# EAGLE design iridia-tam-left-board (EAGLE 6.1)
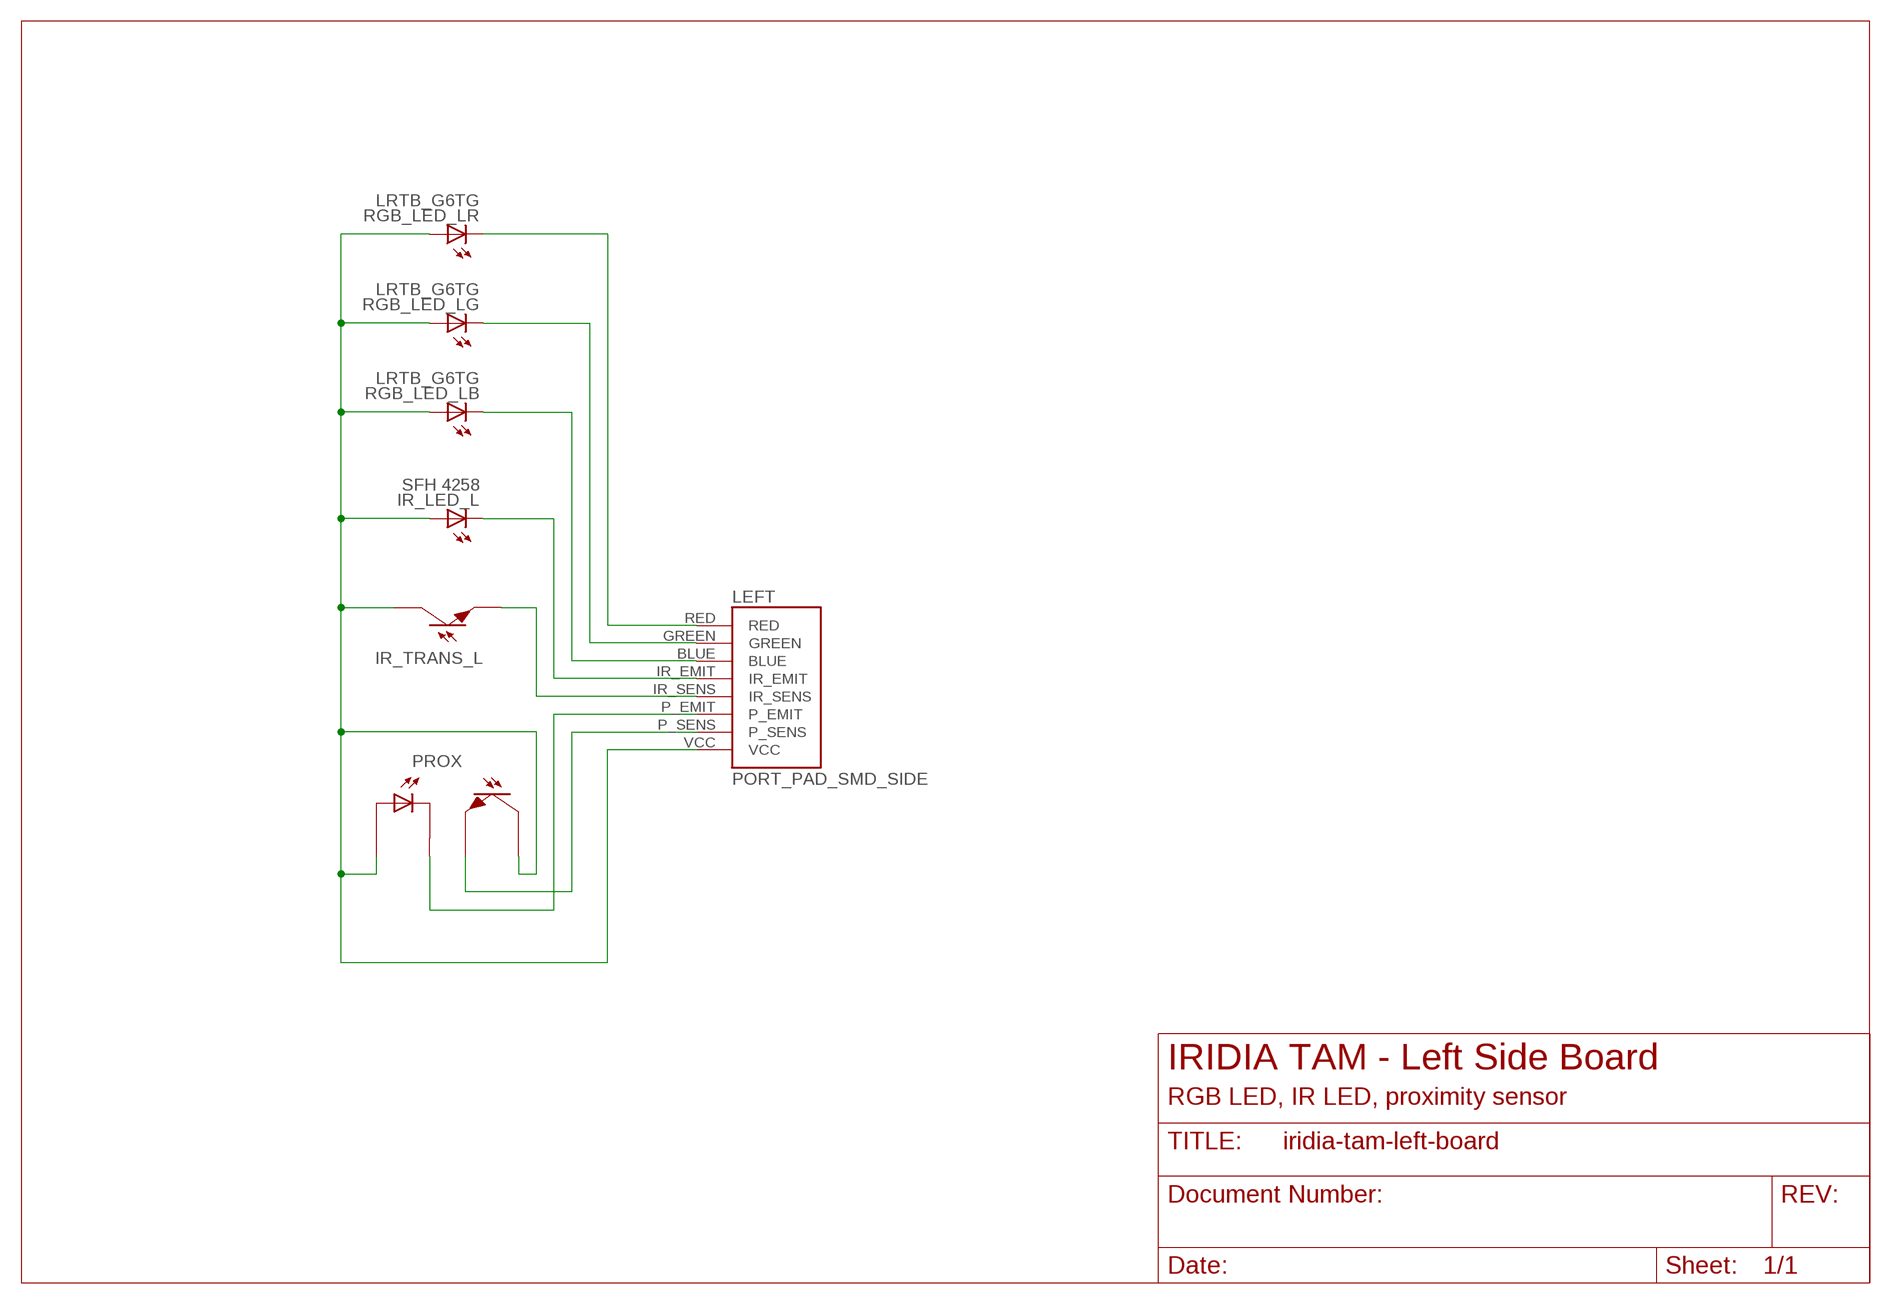
[diagram p0: schematic, sheet 1]

## Parts
IR_LED_L  SFH 4258  LEDP-LCC-4  [P-LCC-4-1C-3A]
IR_TRANS_L  SFH 320 FA  IR_TRANSP-LCC-2  [P-LCC-2-TRANS]
LEFT  PORT_PAD_SMD_SIDE  [PORT_PAD_SMD_SIDE]
PROX  TCRT1000  TCRT1000_TH  [TCRT1000_TH]
RGB_LED_L  LRTB_G6TG  MULTILED_LRTB_G6TG  [P-LCC-6_TOPLED]

## Nets
BLUE_L: LEFT.BLUE RGB_LED_L.C3(B:C)
GREEN_L: LEFT.GREEN RGB_LED_L.C2(G:C)
IR_EMIT_L: IR_LED_L.C@1(C) LEFT.IR_EMIT
IR_SENSE_L: IR_TRANS_L.E LEFT.IR_SENS
PROX_EMIT: LEFT.P_EMIT PROX.CAT
PROX_SENSE: LEFT.P_SENS PROX.E
RED_L: LEFT.RED RGB_LED_L.C1(R:C)
VCC [power]: IR_LED_L.A@2(A) IR_LED_L.A@3(A) IR_LED_L.A@4(A) IR_TRANS_L.COL LEFT.VCC PROX.A PROX.COL RGB_LED_L.A1(R:A) RGB_LED_L.A2(G:A) RGB_LED_L.A3(B:A)

## Notes on the sheet
- IRIDIA TAM - Left Side Board
- RGB LED, IR LED, proximity sensor

## Library data of the parts
IR_LED_L = iridia:LED: LED OSRAM: - CHIPLED LG R971, LG N971, LY N971, LG Q971, LY Q971, LO R971, LY R971 LH N974, LH R974 LS Q976, LO Q976, LY Q976 LO Q996 - Hyper CHIPLED LW Q18S LB Q993, LB Q99A, LB R99A - SideLED LS A670, LO A670, LY A670, LG A670, LP A670 LB A673, LV A673, LT A673, LW A673 LH A674 LY A675 LS A676, LA A676, LO A676, LY A676, LW A676 LS A679, LY A679, LG A679 - Hyper Micro SIDELED® LS Y876, LA Y876, LO Y876, LY Y876 LT Y87S - SmartLED LW L88C, LW L88S LB L89C, LB L89S, LG L890 LS L89K, LO L89K, LY L89K LS L896, LA L896, LO L896, LY L896 - TOPLED LS T670, LO T670, LY T670, LG T670, LP T670 LSG T670, LSP T670, LSY T670, LOP T670, LYG T670 LG T671, LOG T671, LSG T671 LB T673, LV T673, LT T673, LW T673 LH T674 LS T676, LA T676, LO T676, LY T676, LB T676, LH T676, LSB T676, LW T676 LB T67C, LV T67C, LT T67C, LS T67K, LO T67K, LY T67K, LW E67C LS E67B, LA E67B, LO E67B, LY E67B, LB E67C, LV E67C, LT E67C LW T67C LS T679, LY T679, LG T679 LS T770, LO T770, LY T770, LG T770, LP T770 LB T773, LV T773, LT T773, LW T773 LH T774 LS E675, LA E675, LY E675, LS T675 LS T776, LA T776, LO T776, LY T776, LB T776 LHGB T686 LT T68C, LB T68C - Hyper Mini TOPLED® LB M676 - Mini TOPLED Santana® LG M470 LS M47K, LO M47K, LY M47K Source: http://www.osram.convergy.de LUXEON: - LUMILED® LXK2-PW12-R00, LXK2-PW12-S00, LXK2-PW14-U00, LXK2-PW14-V00 LXK2-PM12-R00, LXK2-PM12-S00, LXK2-PM14-U00 LXK2-PE12-Q00, LXK2-PE12-R00, LXK2-PE12-S00, LXK2-PE14-T00, LXK2-PE14-U00 LXK2-PB12-K00, LXK2-PB12-L00, LXK2-PB12-M00, LXK2-PB14-N00, LXK2-PB14-P00, LXK2-PB14-Q00 LXK2-PR12-L00, LXK2-PR12-M00, LXK2-PR14-Q00, LXK2-PR14-R00 LXK2-PD12-Q00, LXK2-PD12-R00, LXK2-PD12-S00 LXK2-PH12-R00, LXK2-PH12-S00 LXK2-PL12-P00, LXK2-PL12-Q00, LXK2-PL12-R00 Source: www.luxeon.com KINGBRIGHT: KA-3528ASYC Source: www.kingbright.com
IR_TRANS_L = iridia:IR_TRANS: IR TRANSITOR Package P-LCC-2 Osram SFH 320, SFH 320 FA
LEFT = iridia:PORT_PAD_SMD_SIDE: Connector pad for soldering side boards on side board of IRIDIA TAM
PROX = iridia:TCRT1000_TH
RGB_LED_L = led:MULTILED_LRTB_G6TG: 6-lead MULTILED® Enhanced optical Power LED (ThinFilm® / ThinGaN®) Source. OSRAM - LRTB_G6TG.pdf

## Net classes
0 default: width 0.254 mm, drill 0.305 mm, clearance 0.152 mm
1 power: width 0.61 mm, drill 0.508 mm, clearance 0.152 mm
2 gnd: width 0.305 mm, drill 0.508 mm, clearance 0.152 mm
3 usbvcc: width 0.508 mm, drill 0.508 mm, clearance 0.152 mm
4 aref: width 0.406 mm

## Board
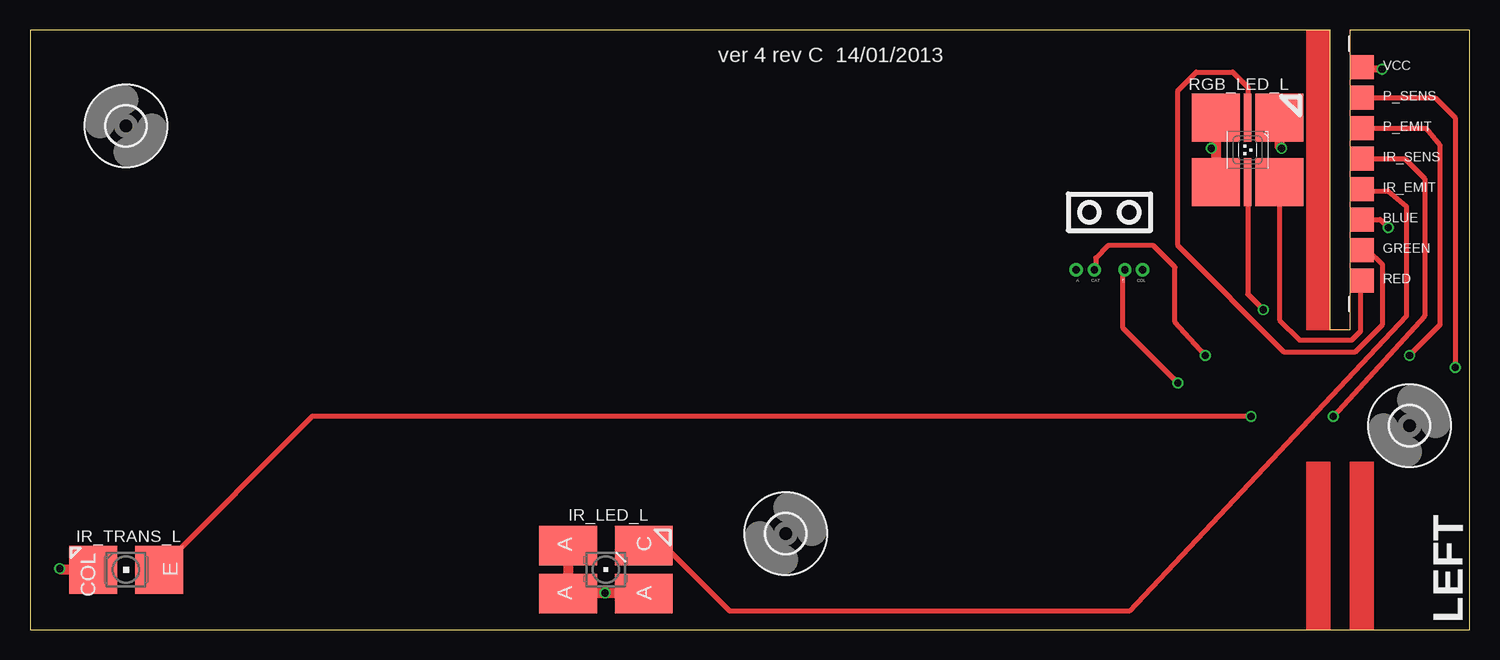
[diagram p1: board, top side]
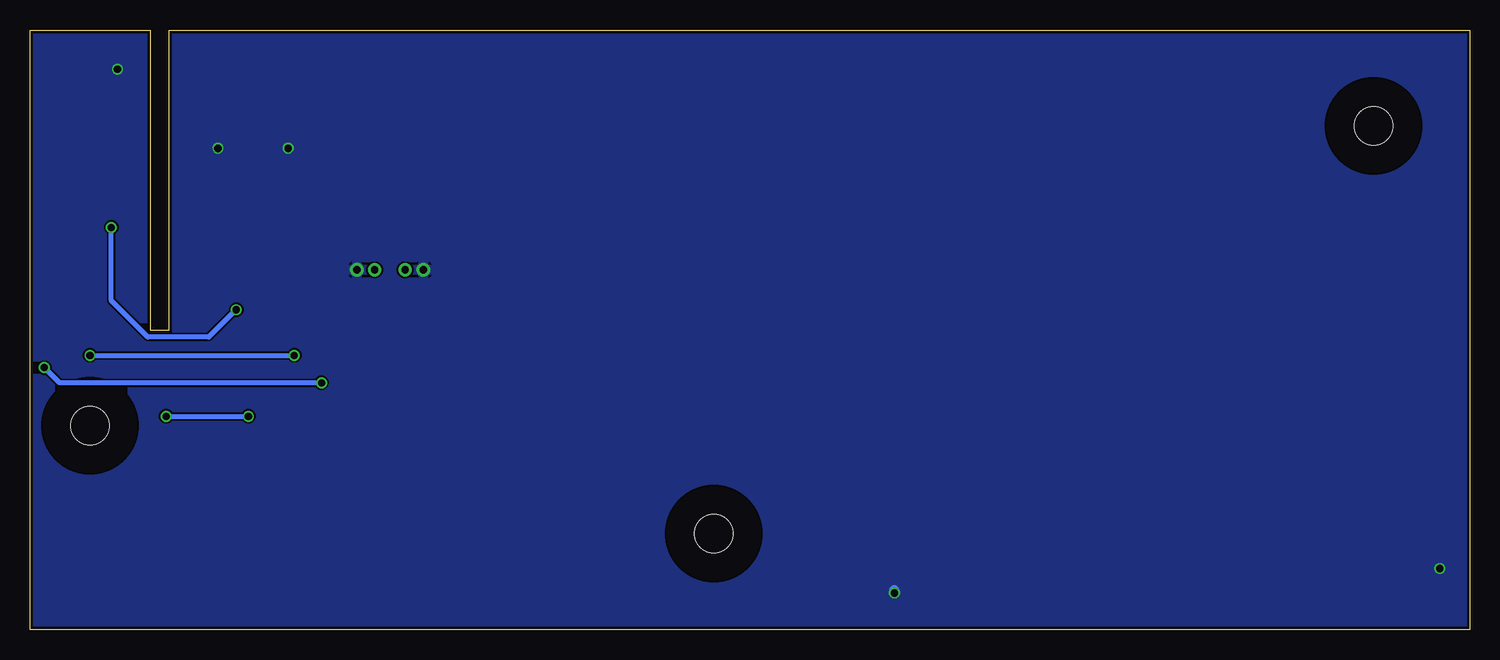
[diagram p2: board, bottom side, seen from below]

Size 120 x 50 mm. Coordinates in mm from the lower left corner, seen from the top.
Outline: 0,0 120,0 120,50 110,50 110,25 108.4,25 108.4,50 0,50 0,0
Copper layers (1*16): Top 0.035mm / dielectric 1.5mm / Bottom 0.035mm
Design rules "default": minimum track width 6mil, minimum drill 12mil, track to track 6mil, track to pad 6mil, pad to pad 6mil, via to via 6mil, smd to smd 0mil, copper to edge 10mil, drill to drill 10mil, minimum pad ring 10mil, minimum via ring 6mil, stop-mask expansion 2mil, vias tented up to drill 100mil, thermal gap 10mil

### Footprints (pad centres in the part's own frame; a part is rotated, then mirrored left to right if it is on the bottom)
P-LCC-4-1C-3A = smd 3.3 x 4.8: A@2 -2,-3.15; A@3 -2,3.15; A@4 2,3.15; C@1 2,-3.15
P-LCC-2-TRANS = smd 4 x 4: COL 0,-2.75; E 0,2.75
PORT_PAD_SMD_SIDE = smd 2 x 2: BLUE 0,-3.81; GREEN 0,-6.35; IR_EMIT 0,-1.27; IR_SENS 0,1.27; P_EMIT 0,3.81; P_SENS 0,6.35; RED 0,-8.89; VCC 0,8.89
TCRT1000_TH = drill 0.6 pad 1.067: A -2.794,0; CAT -1.27,0; COL 2.743,0; E 1.27,0
P-LCC-6_TOPLED = smd 4 x 4: A1 -2.65,-2.7; A2 2.65,-2.7; A3 2.65,2.7; C1 -2.65,2.7 | smd 0.6 x 4: C2 0,-2.7; C3 0,2.7
3,2 = hole 3.2: 0,0

### Placement (x,y rotation side)
IR_LED_L  48,5 90 top
IR_TRANS_L  8,5 270 top
LEFT  111,38 0 top
PROX  90,30 0 top
RGB_LED_L  101.5,40 180 top
U$1  [3,2]  8,42 270 top
U$2  [3,2]  63,8 0 top
U$3  [3,2]  115,17 0 top

### Tracks (layer width: path | path; a pad name or v marks a point on that pad's centre or on a via)
BLUE_L  (via drill 0.6)
  Top 0.254: LEFT.BLUE 111.27,34.04
  Top 0.406: LEFT.BLUE 112.56,34.19 v113.22,33.53 | RGB_LED_L.C3 101.5,27.97 v102.8,26.67
  Bottom 0.406: v102.8,26.67 105.09,24.38 110.17,24.38 113.22,27.43 v113.22,33.53
GREEN_L
  Top 0.254: LEFT.GREEN 111.02,31.49
  Top 0.406: LEFT.GREEN 111.54,31.65 112.71,30.48 112.71,25.4 110.42,23.11 104.58,23.11 95.69,32 95.69,44.96 97.22,46.48 100.26,46.48 101.53,45.21 101.53,42.73 RGB_LED_L.C2
IR_EMIT_L
  Top 0.254: LEFT.IR_EMIT 111.01,36.58
  Top 0.406: 111.01,36.58 113.21,36.58 114.74,35.31 114.74,26.16 91.63,1.52 58.35,1.52 53.02,6.86 51.29,6.86 IR_LED_L.C@1
IR_SENSE_L  (via drill 0.6)
  Top 0.406: LEFT.IR_SENS 114.59,39.27 116.27,37.59 116.27,26.16 v108.65,17.78 | v101.79,17.78 23.53,17.78 IR_TRANS_L.E
  Bottom 0.406: v108.65,17.78 v101.79,17.78
PROX_EMIT  (via drill 0.6)
  Top 0.254: LEFT.P_EMIT 111.11,41.68
  Top 0.406: LEFT.P_EMIT 116.37,41.81 117.54,40.39 117.54,25.4 v115,22.86 | v97.98,22.86 95.44,25.65 95.44,30.23 93.66,32 89.85,32 88.83,30.99 88.83,30.1 PROX.CAT
  Bottom 0.406: v115,22.86 v97.98,22.86
PROX_SENSE  (via drill 0.6)
  Top 0.406: LEFT.P_SENS 117.13,44.35 118.81,42.67 v118.81,21.84 | v95.69,20.57 91.12,25.15 91.12,29.85 PROX.E
  Bottom 0.406: v95.69,20.57 117.54,20.57 v118.81,21.84
RED_L
  Top 0.406: 111.02,28.96 LEFT.RED 110.93,29.04 110.93,24.89 110.17,24.13 105.85,24.13 104.15,25.83 RGB_LED_L.C1
VCC  (via drill 0.6)
  Top 0.61: LEFT.VCC 110.65,46.76 v112.71,46.74
  Top 0.813: RGB_LED_L.A3 RGB_LED_L.A2 98.85,40.5 v98.49,40.13 | RGB_LED_L.A1 104.15,40.31 v104.33,40.13 | IR_TRANS_L.COL 2.55,5 v2.47,5.08 | IR_LED_L.A@3 44.89,3.05 | IR_LED_L.A@2 51.1,3.05 v47.94,3.05 44.89,3.05 | IR_LED_L.A@4 44.85,3.09 44.89,3.05
  Bottom 0.813: v47.94,3.05 47.94,3.3
  pour Bottom: 0,50 120,50 120,0 0,0
(copper drawn outside any net)
  shapes: Top area x3

### Text on the board
tPlace: ver 4 rev C 14/01/2013